# Altium schematic sheet УШЯИ.687245.044Э3_2.SchDoc
size 420 x 297 mm; SheetNumber: 2; SheetTotal: 2
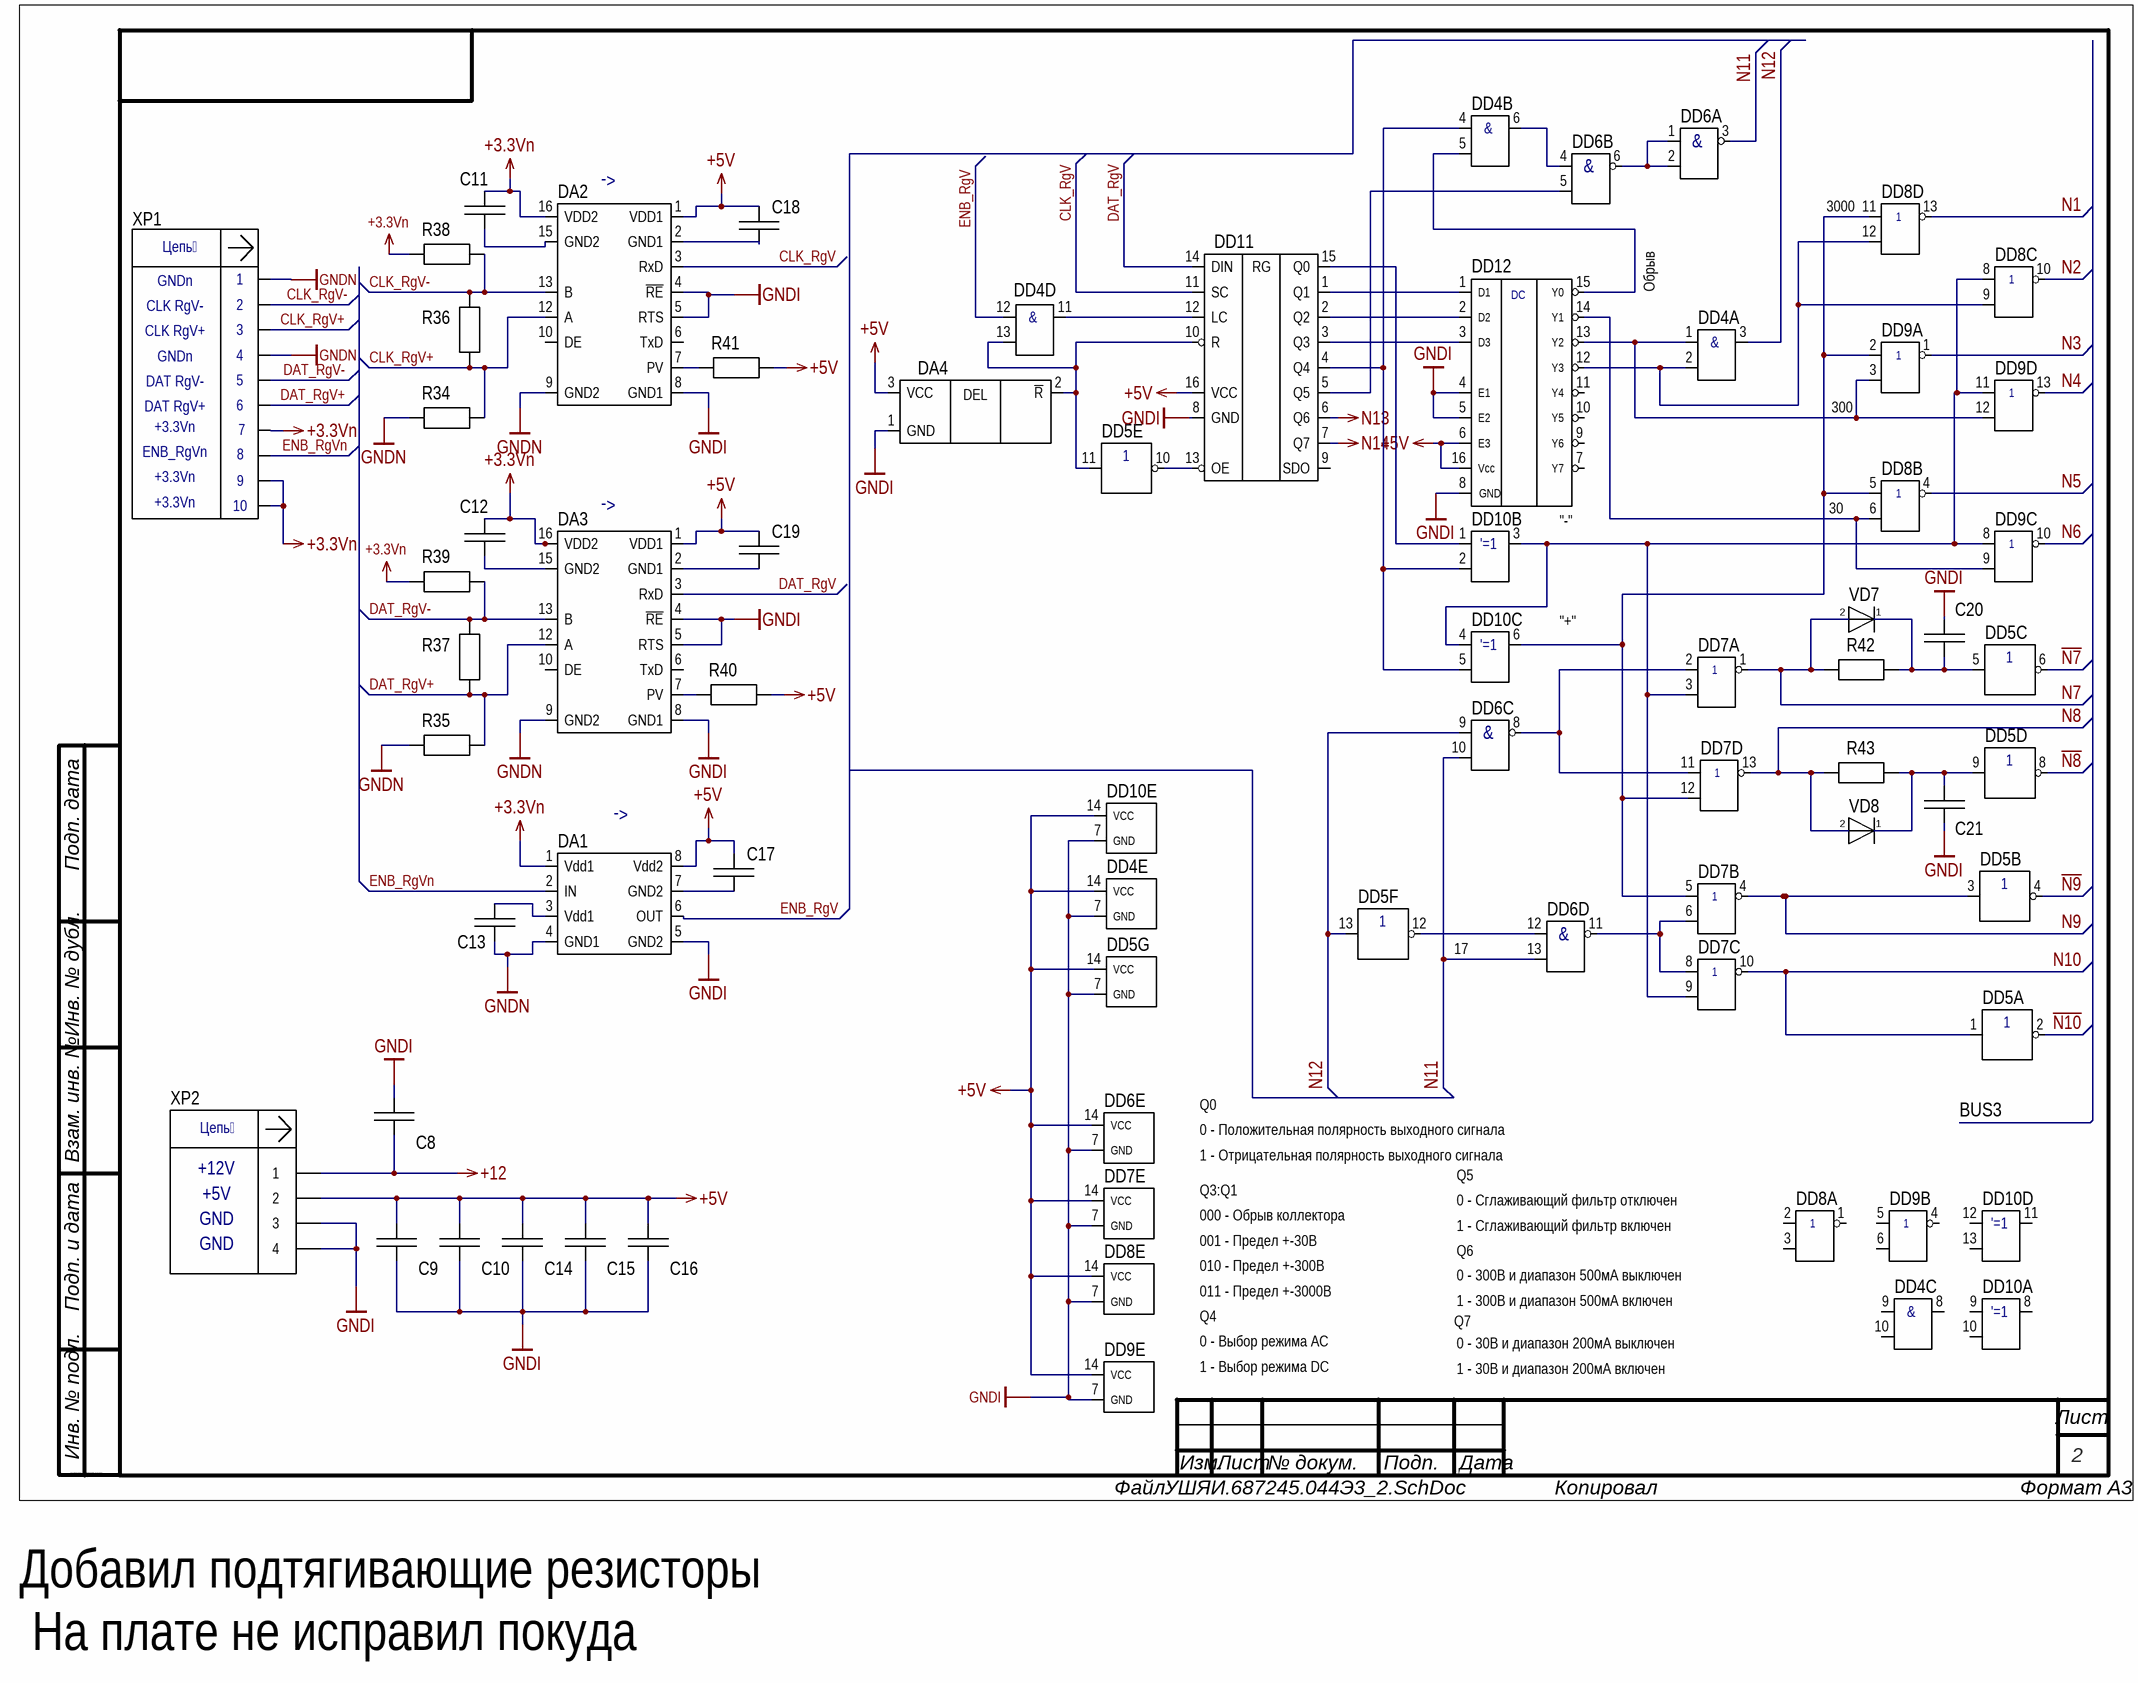
[diagram p0: УШЯИ.687245.044Э3_2.SchDoc]

## Parts
C8  К10-17б-M1500-1200 пФ +-5%  [К10-17Б-L5.6]  (value not drawn)
C9  1206-X7R-50 B-0,33 мкФ+-10%  [CAP: 1206]  (value not drawn)
C10  1206-X7R-50 B-0,33 мкФ+-10%  [CAP: 1206]  (value not drawn)
C11  0805-X7R-25 В-0,1 мкФ +-10%  [CAP: 0805]  (value not drawn)
C12  0805-X7R-25 В-0,1 мкФ +-10%  [CAP: 0805]  (value not drawn)
C13  0805-X7R-25 В-0,1 мкФ +-10%  [CAP: 0805]  (value not drawn)
C14  1206-X7R-50 B-0,33 мкФ+-10%  [CAP: 1206]  (value not drawn)
C15  1206-X7R-50 B-0,33 мкФ+-10%  [CAP: 1206]  (value not drawn)
C16  1206-X7R-50 B-0,33 мкФ+-10%  [CAP: 1206]  (value not drawn)
C17  0805-X7R-25 В-0,1 мкФ +-10%  [CAP: 0805]  (value not drawn)
C18  0805-X7R-25 В-0,1 мкФ +-10%  [CAP: 0805]  (value not drawn)
C19  0805-X7R-25 В-0,1 мкФ +-10%  [CAP: 0805]  (value not drawn)
C20  1206-X7R-50 B-0,33 мкФ+-10%  [CAP: 1206]  (value not drawn)
C21  1206-X7R-50 B-0,33 мкФ+-10%  [CAP: 1206]  (value not drawn)
DA1  ADuM1100AR  [8-SOIC]  (value not drawn)
DA2  ADM2486BRWZ  [16-SOIC-W]  (value not drawn)
DA3  ADM2486BRWZ  [16-SOIC-W]  (value not drawn)
DA4  MAX809S  [SOT-23-3]  (value not drawn)
DD4  IN74HC08AD  [14-SOIC]  (value not drawn)  (parts A,B,C,D,E of 5)
DD5  IN74HC04AD  [14-SOIC]  (value not drawn)  (parts A,B,C,D,E,F,G of 7)
DD6  IN74HC00AD  [14-soic]  (value not drawn)  (parts A,B,C,D,E of 5)
DD7  IN74HC02AD  [14-SOIC]  (value not drawn)  (parts A,B,C,D,E of 5)
DD8  IN74HC02AD  [14-SOIC]  (value not drawn)  (parts A,B,C,D,E of 5)
DD9  IN74HC02AD  [14-SOIC]  (value not drawn)  (parts A,B,C,D,E of 5)
DD10  IN74HC86AD  [14-SOIC]  (value not drawn)  (parts A,B,C,D,E of 5)
DD11  IN74HC595AD  [16-SOIC]  (value not drawn)
DD12  IN74HC138AD  [16-SOIC]  (value not drawn)
R34  1206-1 кОм+-5%  [1206]  (value not drawn)
R35  1206-1 кОм+-5%  [1206]  (value not drawn)
R36  1206-100 Ом+-5%  [1206]  (value not drawn)
R37  1206-100 Ом+-5%  [1206]  (value not drawn)
R38  1206-1 кОм+-5%  [1206]  (value not drawn)
R39  1206-1 кОм+-5%  [1206]  (value not drawn)
R40  1206-12 кОм+-5%  [1206]  (value not drawn)
R41  1206-12 кОм+-5%  [1206]  (value not drawn)
R42  1206-22 кОм+-5%  [1206]  (value not drawn)
R43  1206-22 кОм+-5%  [1206]  (value not drawn)
VD7  1N4148WS  [SOD-323F]  (value not drawn)
VD8  1N4148WS  [SOD-323F]  (value not drawn)
XP1  BH2-10  [DS1014-10S]  (value not drawn)
XP2  280371-2  [280371-2]  (value not drawn)

## Nets
+3.3Vn: C11.2 C12.2 DA1.1(Vdd1) DA2.16(VDD2) DA3.16(VDD2) R38.2 R39.2 XP1.7 XP1.9 XP1.10
+5V: C9.2 C10.2 C14.2 C15.2 C16.2 C17.1 C18.2 C19.2 DA1.8(Vdd2) DA2.1(VDD1) DA3.1(VDD1) DA4.3(VCC) DD4.14(VCC) DD5.14(VCC) DD6.14(VCC) DD7.14(VCC) DD8.14(VCC) DD9.14(VCC) DD10.14(VCC) DD11.16(VCC) DD12.6(E3) DD12.16(Vcc) R40.1 R41.1 XP2.2
+12: C8.1 XP2.1
GNDI: C8.2 C9.1 C10.1 C14.1 C15.1 C16.1 C20.2 C21.1 DA1.5(GND2) DA2.4(~{RE}) DA2.5(RTS) DA2.8(GND1) DA3.4(~{RE}) DA3.5(RTS) DA3.8(GND1) DA4.1(GND) DD4.7(GND) DD5.7(GND) DD6.7(GND) DD7.7(GND) DD8.7(GND) DD9.7(GND) DD10.7(GND) DD11.8(GND) DD12.4(E1) DD12.5(E2) DD12.8(GND) XP2.3 XP2.4
GNDN: C13.1 DA1.4(GND1) DA2.9(GND2) DA3.9(GND2) R34.1 R35.1 XP1.1 XP1.4
N13: DD11.6(Q6)
N14: DD11.7(Q7)
~{N7}: DD5.6(Y3)
~{N8}: DD5.8(Y4)
~{N9}: DD5.4(Y2)
~{N10}: DD5.2(Y1)
CLK_RgV: DA2.3(RxD) DD11.11(SC)
CLK_RgV+: DA2.12(A) R34.2 R36.1 XP1.3
CLK_RgV-: DA2.13(B) R36.2 R38.1 XP1.2
DAT_RgV: DA3.3(RxD) DD11.14(DIN)
DAT_RgV+: DA3.12(A) R35.2 R37.1 XP1.6
DAT_RgV-: DA3.13(B) R37.2 R39.1 XP1.5
ENB_RgV: DA1.6(OUT) DD4.12(A4)
ENB_RgVn: DA1.2(IN) XP1.8
N1: DD8.13(Y4)
N2: DD8.10(Y3)
N3: DD9.1(Y1)
N4: DD9.13(Y4)
N5: DD8.4(Y2)
N6: DD9.10(Y3)
N7: DD7.1(Y1) R42.1 VD7.2
N8: DD7.13(Y4) R43.1 VD8.2
N9: DD5.3(A2) DD7.4(Y2)
N10: DD5.1(A1) DD7.10(Y3)
N11: DD6.3(Y1) DD6.10(B3) DD6.13(B4)
N12: DD4.3(Y1) DD5.13(A6) DD6.9(A3)
NetC11_1: C11.1 DA2.15(GND2)
NetC12_1: C12.1 DA3.15(GND2)
NetC13_2: C13.2 DA1.3(Vdd1)
NetC17_2: C17.2 DA1.7(GND2)
NetC18_1: C18.1 DA2.2(GND1)
NetC19_1: C19.1 DA3.2(GND1)
NetC20_1: C20.1 DD5.5(A3) R42.2 VD7.1
NetC21_2: C21.2 DD5.9(A4) R43.2 VD8.1
NetDA2_7: DA2.7(PV) R41.2
NetDA3_7: DA3.7(PV) R40.2
NetDA4_2: DA4.2(~{R}) DD4.13(B4) DD5.11(A5) DD11.10(R)
NetDD4_1: DD4.1(A1) DD9.3(B1) DD9.12(B4) DD12.13(Y2)
NetDD4_2: DD4.2(B1) DD8.9(B3) DD8.12(B4) DD12.12(Y3)
NetDD4_4: DD4.4(A2) DD10.2(B1) DD10.5(B2) DD11.4(Q4)
NetDD4_5: DD4.5(B2) DD12.15(Y0)
NetDD4_6: DD4.6(Y2) DD6.4(A2)
NetDD4_11: DD4.11(Y4) DD11.12(LC)
NetDD5_10: DD5.10(Y5) DD11.13(OE)
NetDD5_12: DD5.12(Y6) DD6.12(A4)
NetDD6_1: DD6.1(A1) DD6.2(B1) DD6.6(Y2)
NetDD6_5: DD6.5(B2) DD11.5(Q5)
NetDD6_8: DD6.8(Y3) DD7.2(A1) DD7.11(A4)
NetDD6_11: DD6.11(Y4) DD7.6(B2) DD7.8(A3)
NetDD7_3: DD7.3(B1) DD7.9(B3) DD8.8(A3) DD9.8(A3) DD9.11(A4) DD10.3(Y1) DD10.4(A2)
NetDD7_5: DD7.5(A2) DD7.12(B4) DD8.5(A2) DD8.11(A4) DD9.2(A1) DD10.6(Y2)
NetDD8_6: DD8.6(B2) DD9.9(B3) DD12.14(Y1)
NetDD10_1: DD10.1(A1) DD11.15(Q0)
NetDD11_1: DD11.1(Q1) DD12.1(D1)
NetDD11_2: DD11.2(Q2) DD12.2(D2)
NetDD11_3: DD11.3(Q3) DD12.3(D3)

Not connected (* = marked no-connect by the designer): DA2 6(TxD) 10(DE); DA3 6(TxD) 10(DE); DD4 8(Y3) 9(A3) 10(B3); DD8 1(Y1) 2(A1) 3(B1); DD9 4(Y2) 5(A2) 6(B2); DD10 8(Y3) 9(A3) 10(B3) 11(Y4) 12(A4) 13(B4); DD11 9(SDO); DD12 7(Y7) 9(Y6) 10(Y5) 11(Y4)

## Notes on the sheet
- (near DA2) <-
- (near DD8) 3000
- GNDn
- (near XP1) CLK RgV-
- Обрыв
- (near XP1) CLK RgV+
- (near XP1) DAT RgV-
- (near XP1) DAT RgV+
- +3.3Vn
- (near DD9) 300
- (near XP1) ENB_RgVn
- (near DA3) <-
- (near DD12) "-"
- (near DD8) 30
- "+"
- (near DA1) <-
- (near DD5) 17
- Q0
- 0 - Положительная полярность выходного сигнала
- BUS3
- +5V
- +12V
- Q3:Q1
- 1 - Отрицательная полярность выходного сигнала
- Q5
- 0 - Сглаживающий фильтр отключен
- GND
- 000 - Обрыв коллектора
- 001 - Предел +-30В
- 010 - Предел +-300В
- Q6
- 1 - Сглаживающий фильтр включен
- Q4
- 011 - Предел +-3000В
- Q7
- 0 - 300В и диапазон 500мА выключен
- 1 - 300В и диапазон 500мА включен
- 0 - Выбор режима AC
- 1 - Выбор режима DC
- 0 - 30В и диапазон 200мА выключен
- 1 - 30В и диапазон 200мА включен
- Добавил подтягивающие резисторы
- На плате не исправил покуда
- Подп. дата
- Инв. № дубл.
- Взам. инв. №
- Подп. и дата
- Инв. № подл.
- Изм.
- Лист
- № докум.
- Подп.
- Дата
- ALTIUM GOSTBOM2.0 KEV
- Файл:
- Копировал
- Формат А3
- (in symbol 280371-2) Цепь
- (in symbol BH2-10) Цепь
- (in symbol IN74HC00AD, part A) &
- (in symbol IN74HC00AD, part B) &
- (in symbol IN74HC00AD, part C) &
- (in symbol IN74HC00AD, part D) &
- (in symbol IN74HC08AD, part A) &
- (in symbol IN74HC08AD, part B) &
- (in symbol IN74HC08AD, part C) &
- (in symbol IN74HC08AD, part D) &
- (in symbol IN74HC86AD, part A) '=1
- (in symbol IN74HC86AD, part B) '=1
- (in symbol IN74HC86AD, part C) '=1
- (in symbol IN74HC86AD, part D) '=1
- (in symbol IN74HC138AD) DC
- (in symbol IN74HC595AD) RG
- (in symbol MAX809S) DEL

## Library data of the parts
C11-C13 C17-C19 = 0805-X7R-25 В-0,1 мкФ +-10%: Value: 0,1 мкФ
DA1 = ADuM1100AR: iCoupler Digital Isolator
DA2 DA3 = ADM2486BRWZ: Isolated RS-485 Transceiver,  20 Mbps data rate, SOIC-16-W
DA4 = MAX809S: Very Low Supply Current / 3-Pin Microprocessor Reset / Monitors
DD4 = IN74HC08AD: Quad 2-Input AND Gate High-Performance Silicon-Gate CMOS
DD6 = IN74HC00AD: Quad 2-Input NAND Gate High-Performance Silicon-Gate CMOS.
DD7-DD9 = IN74HC02AD: Quad 2-Input NOR Gate
DD10 = IN74HC86AD: Quad 2-Input Exclusive / OR Gate
DD11 = IN74HC595AD: 8-Bit SIPO Register w/ Latch & 3-State
DD12 = IN74HC138AD: Дешифратор-демультиплексор IN74HC138A / 3-8 с инверсией на выходе
R34 R35 R38 R39 = 1206-1 кОм+-5%: Value: 1 кОм; ModelPrint: 1206
R36 R37 = 1206-100 Ом+-5%: Value: 100 Ом; ModelPrint: 1206
R40 R41 = 1206-12 кОм+-5%: Value: 12 кОм; ModelPrint: 1206
R42 R43 = 1206-22 кОм+-5%: Value: 22 кОм; ModelPrint: 1206
VD7 VD8 = 1N4148WS: Small Signal Fast Switching Diod; Value: *
XP1 = BH2-10: DS1014-10 Straight; System: Connector
XP2 = 280371-2: Connector; System: Connector
C8 = К10-17б-M1500-1200 пФ +-5%: Value: *
C9 C10 C14-C16 C20 C21 = 1206-X7R-50 B-0,33 мкФ+-10%: Value: 0,33 мкФ